# Altium schematic sheet Core.SchDoc: Core
size A3; PageSetup: Record=PageOptions|CenterHorizontal=True|CenterVertical=True|PrintScale=1.00|XCorrection=1.00|YCorrection=1.00|PrintKind=1|BorderSize=5000000|LeftOffset=0|BottomOffset=0|Orientation=2|PaperLength=1000|PaperWidth=1000|Scale=100|PaperSource=15|PrintQuality=1200|MediaType=1|DitherType=10|PrintScaleMode=1|PaperKind=A4|PaperIndex=9; Organization: Altium Limited; Address1: L3, 12a Rodborough Rd; Address2: Frenchs Forest; Address3: NSW; Address4: Australia 2086; DocumentNumber: 2; Revision: 1.0; SheetNumber: 2; SheetTotal: 8; SheetSize: A3
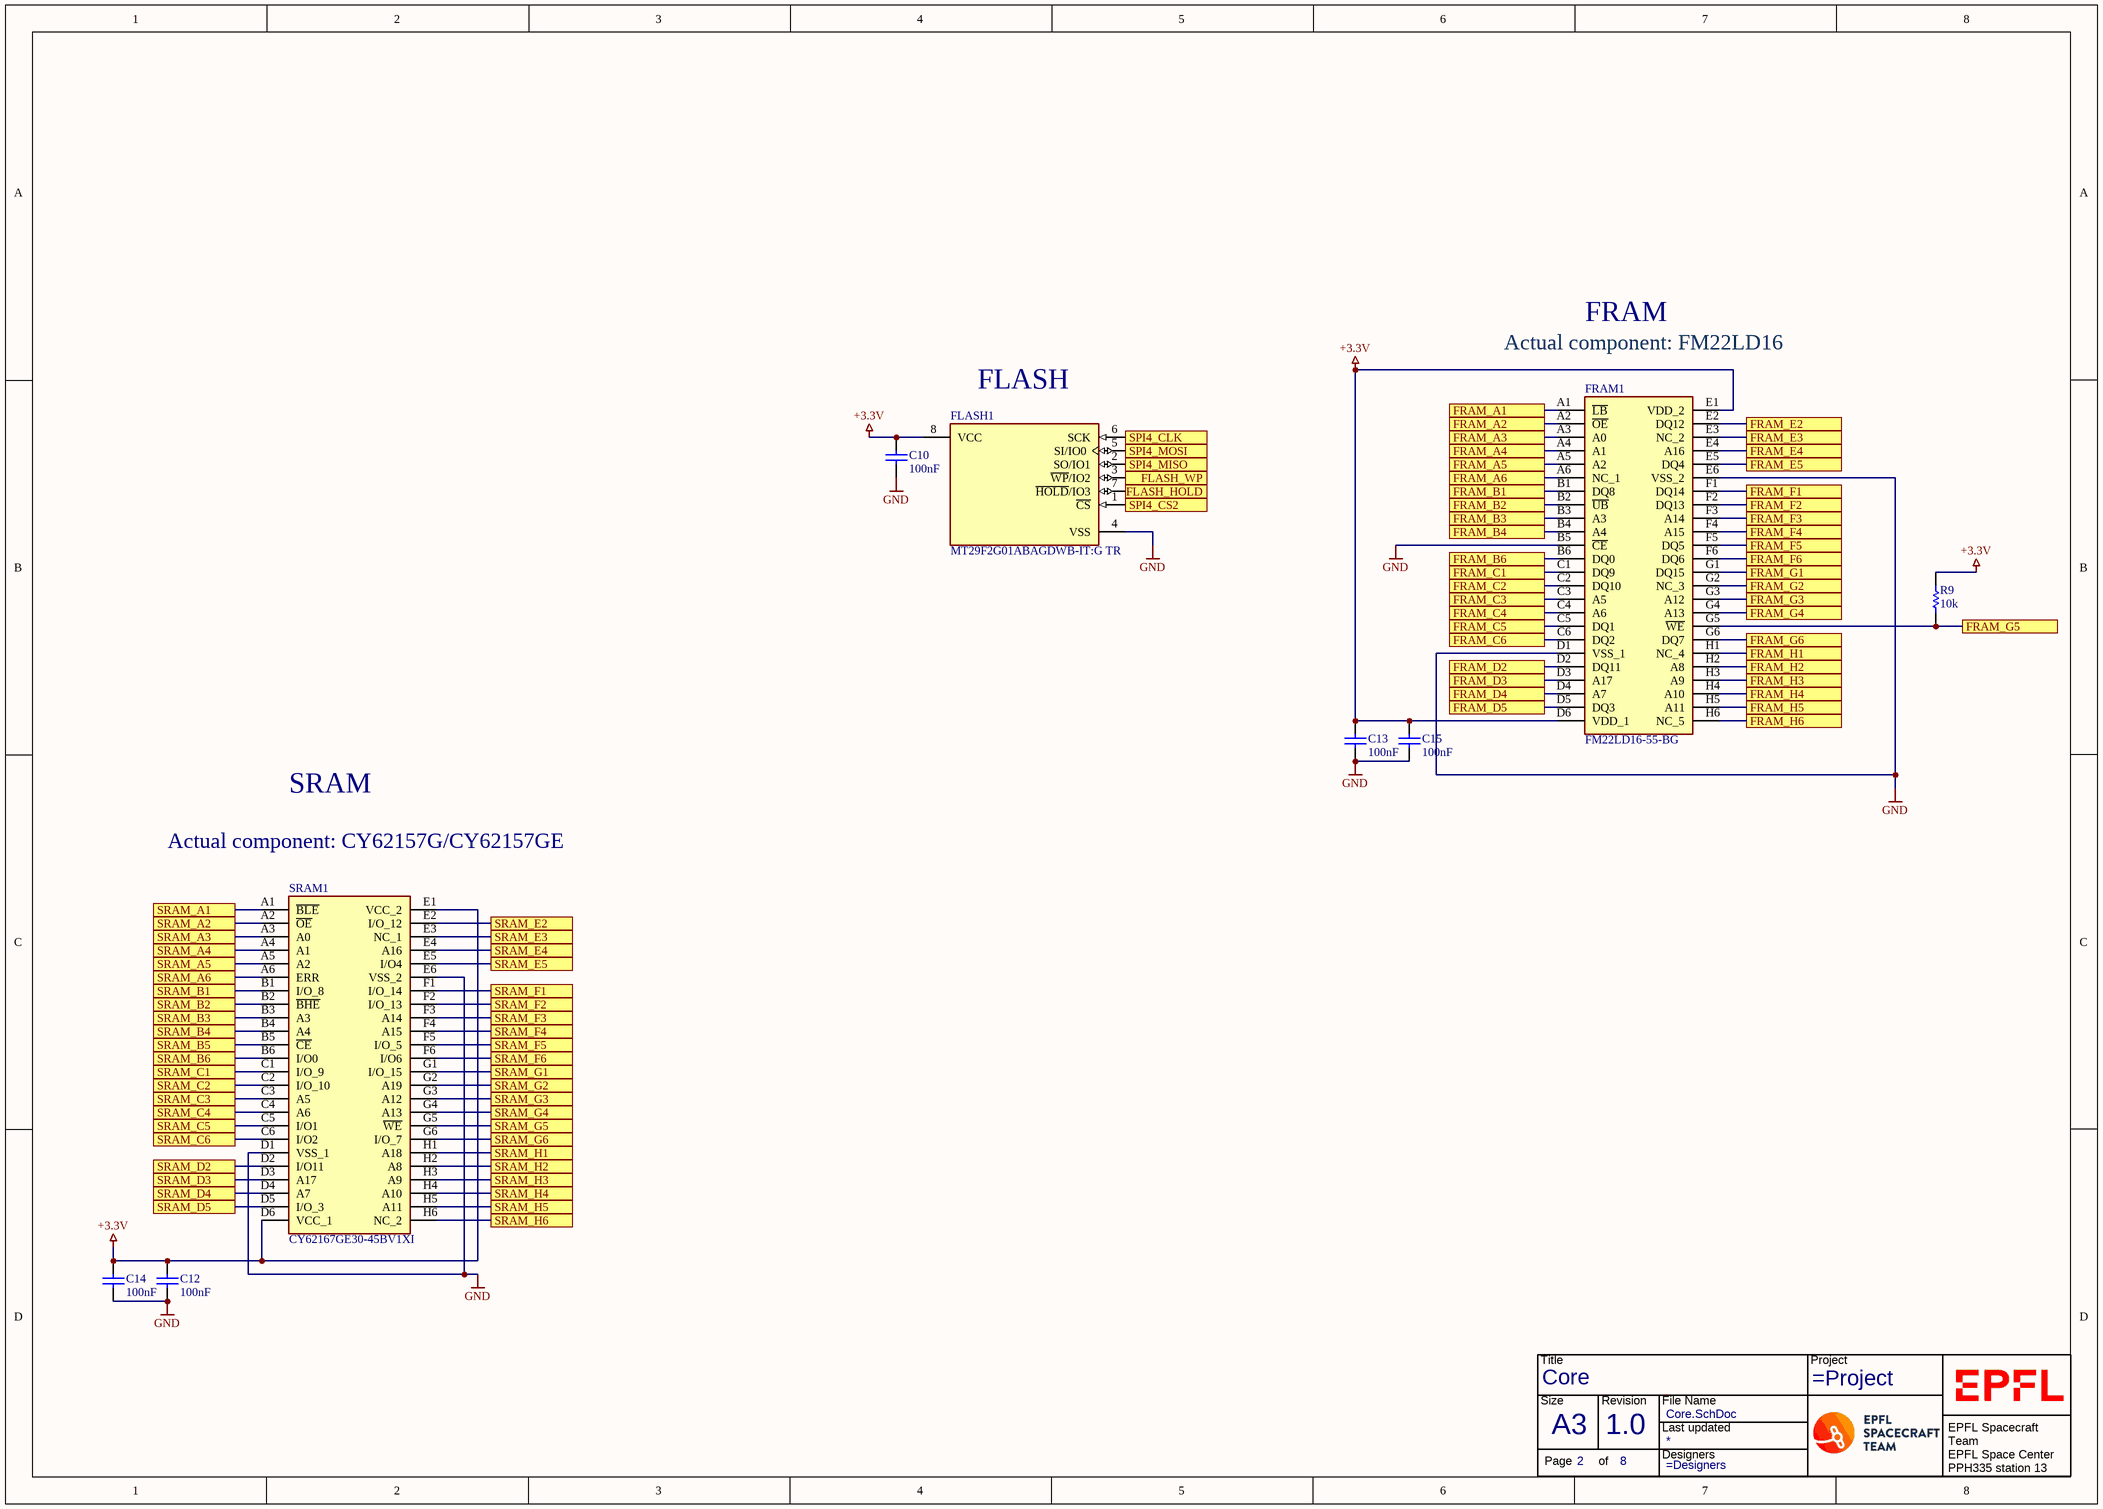
[diagram p0: Core.SchDoc]

## Parts
*  TitleBlock  (value not drawn)  (graphical)
C10  100nF  [CAPC1005X60X30ML05T10]
C12  100nF  [CAPC1005X60X30ML05T10]
C13  100nF  [CAPC1005X60X30ML05T10]
C14  100nF  [CAPC1005X60X30ML05T10]
C15  100nF  [CAPC1005X60X30ML05T10]
FLASH1  MT29F2G01ABAGDWB-IT:G TR  [FP-WB-IPC_C]
FRAM1  FM22LD16-55-BG  [BGA48C75P6X8_600X800X120]
R9  10k  [RESC1005X40X25LL05T10]
SRAM1  CY62167GE30-45BV1XI  [BGA48C75P6X8_600X800X100]

## Ports
FLASH_HOLD, FLASH_WP, FRAM_A1, FRAM_A2, FRAM_A3, FRAM_A4, FRAM_A5, FRAM_A6, FRAM_B1, FRAM_B2, FRAM_B3, FRAM_B4, FRAM_B6, FRAM_C1, FRAM_C2, FRAM_C3, FRAM_C4, FRAM_C5, FRAM_C6, FRAM_D2, FRAM_D3, FRAM_D4, FRAM_D5, FRAM_E2, FRAM_E3, FRAM_E4, FRAM_E5, FRAM_F1, FRAM_F2, FRAM_F3, FRAM_F4, FRAM_F5, FRAM_F6, FRAM_G1, FRAM_G2, FRAM_G3, FRAM_G4, FRAM_G5, FRAM_G6, FRAM_H1, FRAM_H2, FRAM_H3, FRAM_H4, FRAM_H5, FRAM_H6, SPI4_CLK, SPI4_CS2, SPI4_MISO, SPI4_MOSI, SRAM_A1, SRAM_A2, SRAM_A3, SRAM_A4, SRAM_A5, SRAM_A6, SRAM_B1, SRAM_B2, SRAM_B3, SRAM_B4, SRAM_B5, SRAM_B6, SRAM_C1, SRAM_C2, SRAM_C3, SRAM_C4, SRAM_C5, SRAM_C6, SRAM_D2, SRAM_D3, SRAM_D4, SRAM_D5, SRAM_E2, SRAM_E3, SRAM_E4, SRAM_E5, SRAM_F1, SRAM_F2, SRAM_F3, SRAM_F4, SRAM_F5, SRAM_F6, SRAM_G1, SRAM_G2, SRAM_G3, SRAM_G4, SRAM_G5, SRAM_G6, SRAM_H1, SRAM_H2, SRAM_H3, SRAM_H4, SRAM_H5, SRAM_H6

## Nets
+3.3V: C10.2 C12.2 C13.2 C14.2 C15.2 FLASH1.8(VCC) FRAM1.D6(VDD_1) FRAM1.E1(VDD_2) R9.2 SRAM1.D6(VCC_1) SRAM1.E1(VCC_2)
GND: C10.1 C12.1 C13.1 C14.1 C15.1 FLASH1.4(VSS) FRAM1.B5(~{CE}) FRAM1.D1(VSS_1) FRAM1.E6(VSS_2) SRAM1.D1(VSS_1) SRAM1.E6(VSS_2)
FLASH_HOLD: FLASH1.7(~{HOLD}/IO3) ; port FLASH_HOLD
FLASH_WP: FLASH1.3(~{WP}/IO2) ; port FLASH_WP
FRAM_A1: FRAM1.A1(~{LB}) ; port FRAM_A1
FRAM_A2: FRAM1.A2(~{OE}) ; port FRAM_A2
FRAM_A3: FRAM1.A3(A0) ; port FRAM_A3
FRAM_A4: FRAM1.A4(A1) ; port FRAM_A4
FRAM_A5: FRAM1.A5(A2) ; port FRAM_A5
FRAM_A6: FRAM1.A6(NC_1) ; port FRAM_A6
FRAM_B1: FRAM1.B1(DQ8) ; port FRAM_B1
FRAM_B2: FRAM1.B2(~{UB}) ; port FRAM_B2
FRAM_B3: FRAM1.B3(A3) ; port FRAM_B3
FRAM_B4: FRAM1.B4(A4) ; port FRAM_B4
FRAM_B6: FRAM1.B6(DQ0) ; port FRAM_B6
FRAM_C1: FRAM1.C1(DQ9) ; port FRAM_C1
FRAM_C2: FRAM1.C2(DQ10) ; port FRAM_C2
FRAM_C3: FRAM1.C3(A5) ; port FRAM_C3
FRAM_C4: FRAM1.C4(A6) ; port FRAM_C4
FRAM_C5: FRAM1.C5(DQ1) ; port FRAM_C5
FRAM_C6: FRAM1.C6(DQ2) ; port FRAM_C6
FRAM_D2: FRAM1.D2(DQ11) ; port FRAM_D2
FRAM_D3: FRAM1.D3(A17) ; port FRAM_D3
FRAM_D4: FRAM1.D4(A7) ; port FRAM_D4
FRAM_D5: FRAM1.D5(DQ3) ; port FRAM_D5
FRAM_E2: FRAM1.E2(DQ12) ; port FRAM_E2
FRAM_E3: FRAM1.E3(NC_2) ; port FRAM_E3
FRAM_E4: FRAM1.E4(A16) ; port FRAM_E4
FRAM_E5: FRAM1.E5(DQ4) ; port FRAM_E5
FRAM_F1: FRAM1.F1(DQ14) ; port FRAM_F1
FRAM_F2: FRAM1.F2(DQ13) ; port FRAM_F2
FRAM_F3: FRAM1.F3(A14) ; port FRAM_F3
FRAM_F4: FRAM1.F4(A15) ; port FRAM_F4
FRAM_F5: FRAM1.F5(DQ5) ; port FRAM_F5
FRAM_F6: FRAM1.F6(DQ6) ; port FRAM_F6
FRAM_G1: FRAM1.G1(DQ15) ; port FRAM_G1
FRAM_G2: FRAM1.G2(NC_3) ; port FRAM_G2
FRAM_G3: FRAM1.G3(A12) ; port FRAM_G3
FRAM_G4: FRAM1.G4(A13) ; port FRAM_G4
FRAM_G5: FRAM1.G5(~{WE}) R9.1 ; port FRAM_G5
FRAM_G6: FRAM1.G6(DQ7) ; port FRAM_G6
FRAM_H1: FRAM1.H1(NC_4) ; port FRAM_H1
FRAM_H2: FRAM1.H2(A8) ; port FRAM_H2
FRAM_H3: FRAM1.H3(A9) ; port FRAM_H3
FRAM_H4: FRAM1.H4(A10) ; port FRAM_H4
FRAM_H5: FRAM1.H5(A11) ; port FRAM_H5
FRAM_H6: FRAM1.H6(NC_5) ; port FRAM_H6
SPI4_CLK: FLASH1.6(SCK) ; port SPI4_CLK
SPI4_CS2: FLASH1.1(~{CS}) ; port SPI4_CS2
SPI4_MISO: FLASH1.2(SO/IO1) ; port SPI4_MISO
SPI4_MOSI: FLASH1.5(SI/IO0) ; port SPI4_MOSI
SRAM_A1: SRAM1.A1(~{BLE}) ; port SRAM_A1
SRAM_A2: SRAM1.A2(~{OE}) ; port SRAM_A2
SRAM_A3: SRAM1.A3(A0) ; port SRAM_A3
SRAM_A4: SRAM1.A4(A1) ; port SRAM_A4
SRAM_A5: SRAM1.A5(A2) ; port SRAM_A5
SRAM_A6: SRAM1.A6(ERR) ; port SRAM_A6
SRAM_B1: SRAM1.B1(I/O_8) ; port SRAM_B1
SRAM_B2: SRAM1.B2(~{BHE}) ; port SRAM_B2
SRAM_B3: SRAM1.B3(A3) ; port SRAM_B3
SRAM_B4: SRAM1.B4(A4) ; port SRAM_B4
SRAM_B5: SRAM1.B5(~{CE}) ; port SRAM_B5
SRAM_B6: SRAM1.B6(I/O0) ; port SRAM_B6
SRAM_C1: SRAM1.C1(I/O_9) ; port SRAM_C1
SRAM_C2: SRAM1.C2(I/O_10) ; port SRAM_C2
SRAM_C3: SRAM1.C3(A5) ; port SRAM_C3
SRAM_C4: SRAM1.C4(A6) ; port SRAM_C4
SRAM_C5: SRAM1.C5(I/O1) ; port SRAM_C5
SRAM_C6: SRAM1.C6(I/O2) ; port SRAM_C6
SRAM_D2: SRAM1.D2(I/O11) ; port SRAM_D2
SRAM_D3: SRAM1.D3(A17) ; port SRAM_D3
SRAM_D4: SRAM1.D4(A7) ; port SRAM_D4
SRAM_D5: SRAM1.D5(I/O_3) ; port SRAM_D5
SRAM_E2: SRAM1.E2(I/O_12) ; port SRAM_E2
SRAM_E3: SRAM1.E3(NC_1) ; port SRAM_E3
SRAM_E4: SRAM1.E4(A16) ; port SRAM_E4
SRAM_E5: SRAM1.E5(I/O4) ; port SRAM_E5
SRAM_F1: SRAM1.F1(I/O_14) ; port SRAM_F1
SRAM_F2: SRAM1.F2(I/O_13) ; port SRAM_F2
SRAM_F3: SRAM1.F3(A14) ; port SRAM_F3
SRAM_F4: SRAM1.F4(A15) ; port SRAM_F4
SRAM_F5: SRAM1.F5(I/O_5) ; port SRAM_F5
SRAM_F6: SRAM1.F6(I/O6) ; port SRAM_F6
SRAM_G1: SRAM1.G1(I/O_15) ; port SRAM_G1
SRAM_G2: SRAM1.G2(A19) ; port SRAM_G2
SRAM_G3: SRAM1.G3(A12) ; port SRAM_G3
SRAM_G4: SRAM1.G4(A13) ; port SRAM_G4
SRAM_G5: SRAM1.G5(~{WE}) ; port SRAM_G5
SRAM_G6: SRAM1.G6(I/O_7) ; port SRAM_G6
SRAM_H1: SRAM1.H1(A18) ; port SRAM_H1
SRAM_H2: SRAM1.H2(A8) ; port SRAM_H2
SRAM_H3: SRAM1.H3(A9) ; port SRAM_H3
SRAM_H4: SRAM1.H4(A10) ; port SRAM_H4
SRAM_H5: SRAM1.H5(A11) ; port SRAM_H5
SRAM_H6: SRAM1.H6(NC_2) ; port SRAM_H6

## Notes on the sheet
- Actual component: FM22LD16
- FRAM
- (near FLASH1) FLASH
- Actual component: CY62157G/CY62157GE
- SRAM
- Title
- Size:
- Date:
- A3
- Number:
- Time:
- Revision:
- Sheet
- of
- File:
- (in symbol TitleBlock) Title; Project; Size; Revision; File Name; Last updated; Designers; Page; of; EPFL Spacecraft Team / EPFL Space Center / PPH335 station 13 / CH-1015 Lausanne

## Library data of the parts
* = TitleBlock: Title Block with generall information
C10 C12-C15 = CMP-2008-02046-1: Manufacturer: Kemet; Part Number: C0402C104K8PACTU
FLASH1 = CMP-14958-000013-1: IC FLASH 2G SPI 8UPDFN; Memory Type: Non-Volatile; Memory Size: 2Gb; Max Operating Temperature: 85°C; Mount: Surface Mount; Number of Pins: 8; Packaging: Tape and Reel; Min Operating Temperature: -40°C; Interface: SPI
FRAM1 = FM22LD16-55-BG: Integrated Circuit; Manufacturer_Name: Cypress Semiconductor; Datasheet Link: https://datasheet.datasheetarchive.com/originals/dk/DKDS-12/237922.pdf; Height: 1.2mm; Manufacturer_Part_Number: FM22LD16-55-BG; Mouser Part Number: 877-FM22LD16-55-BG; Mouser Price/Stock: https://www.mouser.com/Search/Refine.aspx?Keyword=877-FM22LD16-55-BG; Arrow Part Number: FM22LD16-55-BG; Arrow Price/Stock: https://www.arrow.com/en/products/fm22ld16-55-bg/cypress-semiconductor
R9 = CMP-2002-07353-1: Part Number: RC0402FR-0710KL; Manufacturer: Yageo / Phycomp
SRAM1 = CY62167GE30-45BV1XI: Integrated Circuit; Manufacturer_Name: Cypress Semiconductor; Datasheet Link: https://datasheet.datasheetarchive.com/originals/dk/DKDS-12/238198.pdf; Height: 1mm; Manufacturer_Part_Number: CY62167GE30-45BV1XI; Mouser Part Number: 727-CY62167GE30BV1XI; Mouser Price/Stock: https://www.mouser.co.uk/ProductDetail/Cypress-Semiconductor/CY62167GE30-45BV1XI/?qs=3FnuM6ZipRIEqfAGSsiEJg%3D%3D; Arrow Part Number: CY62167GE30-45BV1XI; Arrow Price/Stock: https://www.arrow.com/en/products/cy62167ge30-45bv1xi/cypress-semiconductor